# EAGLE design led (EAGLE 9.4.2)
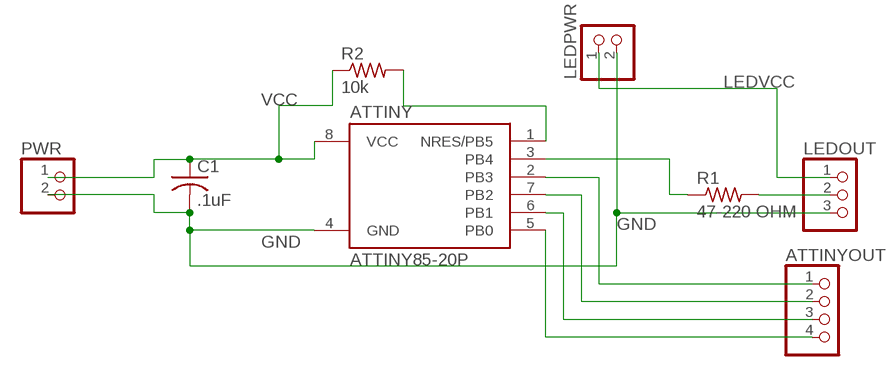
[diagram p0: schematic, sheet 1]

## Parts
ATTINY  ATTINY85-20P  [PDIP08_300MIL]
ATTINYOUT  PINHD-1X4  [1X04]
C1  .1uF  C-US050-025X075  [C050-025X075]
LEDOUT  PINHD-1X3  [1X03]
LEDPWR  PINHD-1X2  [1X02]
PWR  PINHD-1X2  [1X02]
R1  47-220 OHM  R-US_0207/12  [0207/12]
R2  10k  R-US_0207/12  [0207/12]

## Nets
GND: ATTINY.4(GND) C1.2 LEDOUT.3 LEDPWR.2 PWR.2
LEDVCC: LEDOUT.1 LEDPWR.1
N$1: ATTINY.2(PB3) ATTINYOUT.1
N$2: ATTINY.7(PB2) ATTINYOUT.2
N$3: ATTINY.3(PB4) R1.1
N$4: LEDOUT.2 R1.2
N$6: ATTINY.6(PB1) ATTINYOUT.3
N$7: ATTINY.5(PB0) ATTINYOUT.4
N$8: ATTINY.1(NRES/PB5) R2.2
VCC: ATTINY.8(VCC) C1.1 PWR.1 R2.1

## Library data of the parts
ATTINY = _hhn_attiny25_45_85:ATTINY85*: ATMEL ATtiny 85 Packages: P = PDIP 08 30mil S = SOIC 08 EIAJ 208mil Technologies Note: for complete ordering code (temp. range, finish, tape&reel etc.) see www.atmel.com • Supply Voltage: V = (1.8…5.5)V | [blank] = (2.7…5.5)V • Speed: 10 = 10 MHz | 20 = 20 MHz Author: Dipl.-Ing. FH Rainer Bayer HHN Hochschule Heilbronn (Heilbronn University), rainer.bayer@hs-heilbronn.de Ingenieurbüro ing-rb, mail@ing-rb.de
ATTINYOUT = pinhead:PINHD-1X4: PIN HEADER
C1 = rcl:C-US: CAPACITOR, American symbol; SPICEPREFIX: C
LEDOUT = pinhead:PINHD-1X3: PIN HEADER
LEDPWR PWR = pinhead:PINHD-1X2: PIN HEADER
R1 R2 = rcl:R-US_: RESISTOR, American symbol; SPICEPREFIX: R

## Board
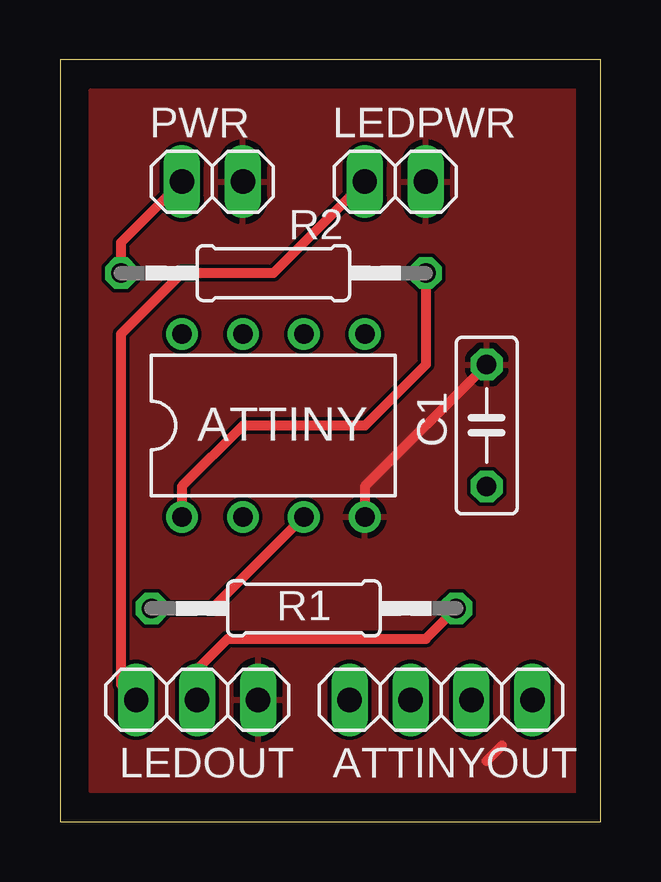
[diagram p1: board, top side]
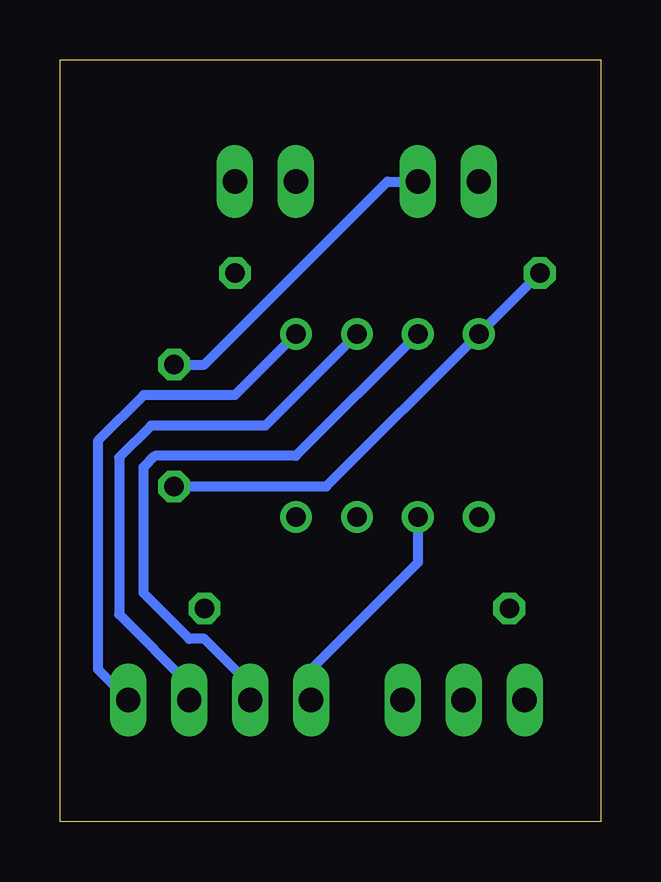
[diagram p2: board, bottom side, seen from below]

Size 22.53 x 31.74 mm. Coordinates in mm from the lower left corner, seen from the top.
Outline: 0,0 22.53,0 22.53,31.74 0,31.74 0,0
Copper layers (1*16): Top 0.035mm / dielectric 1.5mm / Bottom 0.035mm
Design rules "default": minimum track width 6mil, minimum drill 0.35mm, track to track 6mil, track to pad 6mil, pad to pad 6mil, via to via 6mil, smd to smd 6mil, copper to edge 40mil, drill to drill 6mil, minimum pad ring 10mil, minimum via ring 8mil, stop-mask expansion 4mil, vias tented up to drill 0mil, thermal gap 10mil

### Footprints (pad centres in the part's own frame; a part is rotated, then mirrored left to right if it is on the bottom)
PDIP08_300MIL = drill 0.813: 1 -3.81,-3.81; 2 -1.27,-3.81; 3 1.27,-3.81; 4 3.81,-3.81; 5 3.81,3.81; 6 1.27,3.81; 7 -1.27,3.81; 8 -3.81,3.81
1X04 = drill 1.016 long: 1 -3.81,0; 2 -1.27,0; 3 1.27,0; 4 3.81,0
C050-025X075 = drill 0.813 octagon: 1 -2.54,0; 2 2.54,0
1X03 = drill 1.016 long: 1 -2.54,0; 2 0,0; 3 2.54,0
1X02 = drill 1.016 long: 1 -1.27,0; 2 1.27,0
0207/12 = drill 0.813 octagon: 1 -6.35,0; 2 6.35,0

### Placement (x,y rotation side)
ATTINY  8.89,16.51 0 top
ATTINYOUT  15.88,5.08 0 top
C1  17.78,16.51 90 top
LEDOUT  5.71,5.08 0 top
LEDPWR  13.97,26.67 0 top
PWR  6.35,26.67 0 top
R1  10.16,8.89 0 top
R2  8.89,22.86 0 top

### Tracks (layer width: path | path; a pad name or v marks a point on that pad's centre or on a via)
GND
  Top 0.406: C1.2 12.7,13.97 ATTINY.4 | 18.41,3.17 17.78,2.54
  Bottom 0.406: C1.2 16.51,19.05 8.89,26.67 PWR.2
  pour Top: 1.27,30.48 21.59,30.48 21.59,1.27 1.27,1.27
LEDVCC
  Top 0.406: LEDPWR.1 8.89,22.86 5.08,22.86 2.54,20.32 2.54,5.71 LEDOUT.1
N$1
  Bottom 0.406: ATTINY.2 7.62,10.79 12.06,6.35 ATTINYOUT.1
N$2
  Bottom 0.406: ATTINY.7 12.7,15.24 18.58,15.24 19.05,14.77 19.05,9.53 17.14,7.62 16.51,7.62 14.61,5.71 ATTINYOUT.2
N$3
  Top 0.406: ATTINY.3 6.35,8.89 R1.1
N$4
  Top 0.406: R1.2 15.24,7.62 6.99,7.62 5.71,6.35 LEDOUT.2
N$6
  Bottom 0.406: ATTINY.6 13.97,16.51 18.74,16.51 20.07,15.18 20.07,8.64 17.14,5.71 ATTINYOUT.3
N$7
  Bottom 0.406: ATTINYOUT.4 20.95,6.35 20.95,15.88 19.05,17.78 15.24,17.78 ATTINY.5
N$8
  Top 0.406: R2.2 15.24,19.05 12.7,16.51 7.62,16.51 5.08,13.97 ATTINY.1
VCC
  Top 0.406: PWR.1 2.54,24.13 R2.1
  Bottom 0.406: R2.1 ATTINY.8 11.43,13.97 C1.1